# Altium schematic sheet Sch_led.SchDoc
size Letter
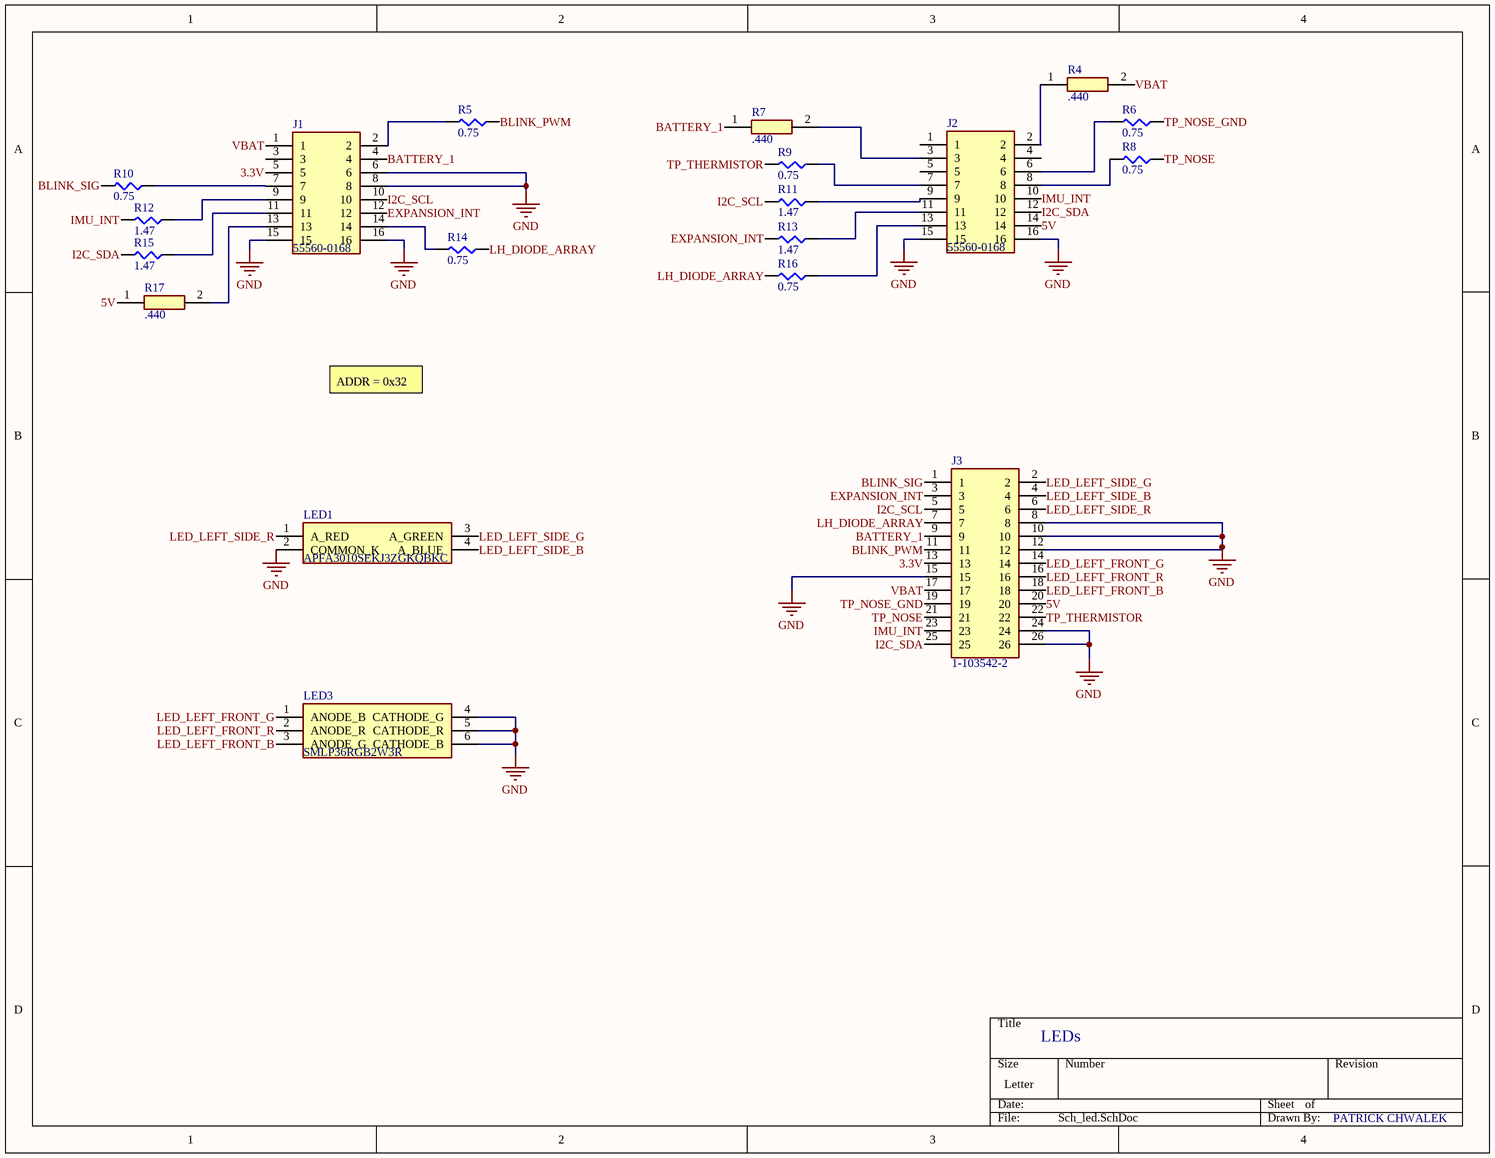
[diagram p0: Sch_led.SchDoc]

## Parts
J1  55560-0168  [555600168]
J2  55560-0168  [555600168]
J3  1-103542-2  [HDRV26W89P254X254_2X13_3261X506X1074P]
LED1  APFA3010SEKJ3ZGKQBKC  [KPFA-3010RGBC-11]
LED3  SMLP36RGB2W3R  [ROHM-1510-(0604)]
R4  .440  [RESAD1650W60L650D250]
R5  0.75  [SMD-0805-RES]
R6  0.75  [SMD-0805-RES]
R7  .440  [RESAD1650W60L650D250]
R8  0.75  [SMD-0805-RES]
R9  0.75  [SMD-0805-RES]
R10  0.75  [SMD-0805-RES]
R11  1.47  [SMD-0805-RES]
R12  1.47  [SMD-0805-RES]
R13  1.47  [SMD-0805-RES]
R14  0.75  [SMD-0805-RES]
R15  1.47  [SMD-0805-RES]
R16  0.75  [SMD-0805-RES]
R17  .440  [RESAD1650W60L650D250]

## Nets
GND: J1.6 J1.8 J1.15 J1.16 J2.15 J2.16 J3.8 J3.10 J3.12 J3.15 J3.24 J3.26 LED1.2(COMMON_K) LED3.4(CATHODE_G) LED3.5(CATHODE_R) LED3.6(CATHODE_B)
3.3V: J1.5 J3.13
5V: J2.14 J3.20 R17.1
BATTERY_1: J1.4 J3.9 R7.1
BLINK_PWM: J3.11 R5.1
BLINK_SIG: J3.1 R10.2
EXPANSION_INT: J1.12 J3.3 R13.2
I2C_SCL: J1.10 J3.5 R11.2
I2C_SDA: J2.12 J3.25 R15.2
IMU_INT: J2.10 J3.23 R12.2
LED_LEFT_FRONT_B: J3.18 LED3.3(ANODE_G)
LED_LEFT_FRONT_G: J3.14 LED3.1(ANODE_B)
LED_LEFT_FRONT_R: J3.16 LED3.2(ANODE_R)
LED_LEFT_SIDE_B: J3.4 LED1.4(A_BLUE)
LED_LEFT_SIDE_G: J3.2 LED1.3(A_GREEN)
LED_LEFT_SIDE_R: J3.6 LED1.1(A_RED)
LH_DIODE_ARRAY: J3.7 R14.1 R16.2
TP_NOSE: J3.21 R8.1
TP_NOSE_GND: J3.19 R6.1
TP_THERMISTOR: J3.22 R9.2
VBAT: J1.1 J3.17 R4.2
NetJ1_2: J1.2 R5.2
NetJ1_7: J1.7 R10.1
NetJ1_9: J1.9 R12.1
NetJ1_11: J1.11 R15.1
NetJ1_13: J1.13 R17.2
NetJ1_14: J1.14 R14.2
NetJ2_2: J2.2 R4.1
NetJ2_3: J2.3 R7.2
NetJ2_6: J2.6 R6.2
NetJ2_7: J2.7 R9.1
NetJ2_8: J2.8 R8.2
NetJ2_9: J2.9 R11.1
NetJ2_11: J2.11 R13.1
NetJ2_13: J2.13 R16.1

Not connected (* = marked no-connect by the designer): J1 3; J2 1 4 5

## Notes on the sheet
- ADDR = 0x32
- LEDs
- PATRICK CHWALEK

## Library data of the parts
J1 J2 = 55560-0168: Connector; Manufacturer_Name: Molex; Allied_Number: 70374726; Datasheet Link: https://www.molex.com/pdm_docs/sd/555600168_sd.pdf; Height: 1.15mm; Manufacturer_Part_Number: 55560-0168; Mouser Part Number: 538-55560-0168; Mouser Price/Stock: https://www.mouser.com/Search/Refine.aspx?Keyword=538-55560-0168; RS Part Number: 7206558P; RS Price/Stock: http://uk.rs-online.com/web/p/products/7206558P; Allied Price/Stock: https://www.alliedelec.com/molexincorporated-55560-0168/70374726/
J3 = 1-103542-2: Connector; Manufacturer_Name: TE Connectivity; Datasheet Link: http://www.te.com/commerce/DocumentDelivery/DDEController?Action=showdoc&DocId=Customer+Drawing%7F103542%7FJ3%7Fpdf%7FEnglish%7FENG_CD_103542_J3.pdf%7F1-103542-2; Height: 10.744mm; Manufacturer_Part_Number: 1-103542-2; Mouser Part Number: 571-1-103542-2; Mouser Price/Stock: https://www.mouser.com/Search/Refine.aspx?Keyword=571-1-103542-2
LED1 = APFA3010SEKJ3ZGKQBKC: LED; Manufacturer_Name: Kingbright; Allied_Number: 70820377; Datasheet Link: http://www.kingbrightusa.com/images/catalog/SPEC/APFA3010SEKJ3ZGKQBKC.pdf; Manufacturer_Part_Number: APFA3010SEKJ3ZGKQBKC; Mouser Part Number: 604-APFA3010SEKJ3ZGK; Mouser Price/Stock: https://www.mouser.com/Search/Refine.aspx?Keyword=604-APFA3010SEKJ3ZGK; Allied Price/Stock: https://www.alliedelec.com/kingbright-apfa3010sekj3zgkqbkc/70820377/
LED3 = SMLP36RGB2W3R: LED; Manufacturer_Name: ROHM Semiconductor; Datasheet Link: http://www.rohm.com/web/global/datasheet/SMLP36RGB2W(R); Manufacturer_Part_Number: SMLP36RGB2W3R; Mouser Part Number: 755-SMLP36RGB2W3R; Mouser Price/Stock: https://www.mouser.com/Search/Refine.aspx?Keyword=755-SMLP36RGB2W3R; RS Part Number: 1246884; RS Price/Stock: https://uk.rs-online.com/web/p/products/1246884
R4 R7 R17 = MRS25000C1000FCT00: Resistor (MOX1CT52RR43J); Manufacturer_Name: Vishay; Datasheet Link: http://www.vishay.com/docs/28724/mrs16m25.pdf; Manufacturer_Part_Number: MRS25000C1000FCT00; Mouser Part Number: 594-MRS25000C1000FCT; Mouser Price/Stock: https://www.mouser.com/Search/Refine.aspx?Keyword=594-MRS25000C1000FCT
R5 R6 R8-R10 R14 R16 = ERJ-2GEJ103X: RES SMD 0.75 OHM 0805; Manufacturer: Panasonic Electronic Components; Factory Stock: 0; Unit Price (USD): 0.00350; @ qty: 1500; Minimum Quantity: 1; Tolerance: ±5%; Power (Watts): 0.1W, 1/10W; Temperature Coefficient: ±200ppm/°C; Part Number: ERJ-2GEJ103X; Datasheets: http://industrial.panasonic.com/www-cgi/jvcr13pz.cgi?E+PZ+3+AOA0001+ERJ2GEJ103X+7+WW; Image: //media.digikey.com/Photos/Panasonic%20Photos/ERJ-PA2-Series.jpg; Digi-Key Part Number: P10KJCT-ND; Quantity Available: 2560215; Packaging: Cut Tape (CT); Series: ERJ; Part Status: Active; Value: 0.75; Composition: Thick Film; Features: Automotive AEC-Q200; Operating Temperature: -55°C ~ 155°C; Package / Case: 0402 (1005 Metric); Supplier Device Package: 0805; Size / Dimension: 0.039" L x 0.020" W (1.00mm x 0.50mm); Height - Seated (Max): 0.016" (0.40mm); Number of Terminations: 2; Failure Rate: -
R11-R13 R15 = ERJ-2GEJ103X: RES SMD 1.47 OHM 0805; Manufacturer: Panasonic Electronic Components; Factory Stock: 0; Unit Price (USD): 0.00350; @ qty: 1500; Minimum Quantity: 1; Tolerance: ±5%; Power (Watts): 0.1W, 1/10W; Temperature Coefficient: ±200ppm/°C; Part Number: ERJ-2GEJ103X; Datasheets: http://industrial.panasonic.com/www-cgi/jvcr13pz.cgi?E+PZ+3+AOA0001+ERJ2GEJ103X+7+WW; Image: //media.digikey.com/Photos/Panasonic%20Photos/ERJ-PA2-Series.jpg; Digi-Key Part Number: P10KJCT-ND; Quantity Available: 2560215; Packaging: Cut Tape (CT); Series: ERJ; Part Status: Active; Value: 1.47; Composition: Thick Film; Features: Automotive AEC-Q200; Operating Temperature: -55°C ~ 155°C; Package / Case: 0402 (1005 Metric); Supplier Device Package: 0805; Size / Dimension: 0.039" L x 0.020" W (1.00mm x 0.50mm); Height - Seated (Max): 0.016" (0.40mm); Number of Terminations: 2; Failure Rate: -